# EAGLE design 2022-06-23 LN2 Autofill Controller (EAGLE 9.6.2)
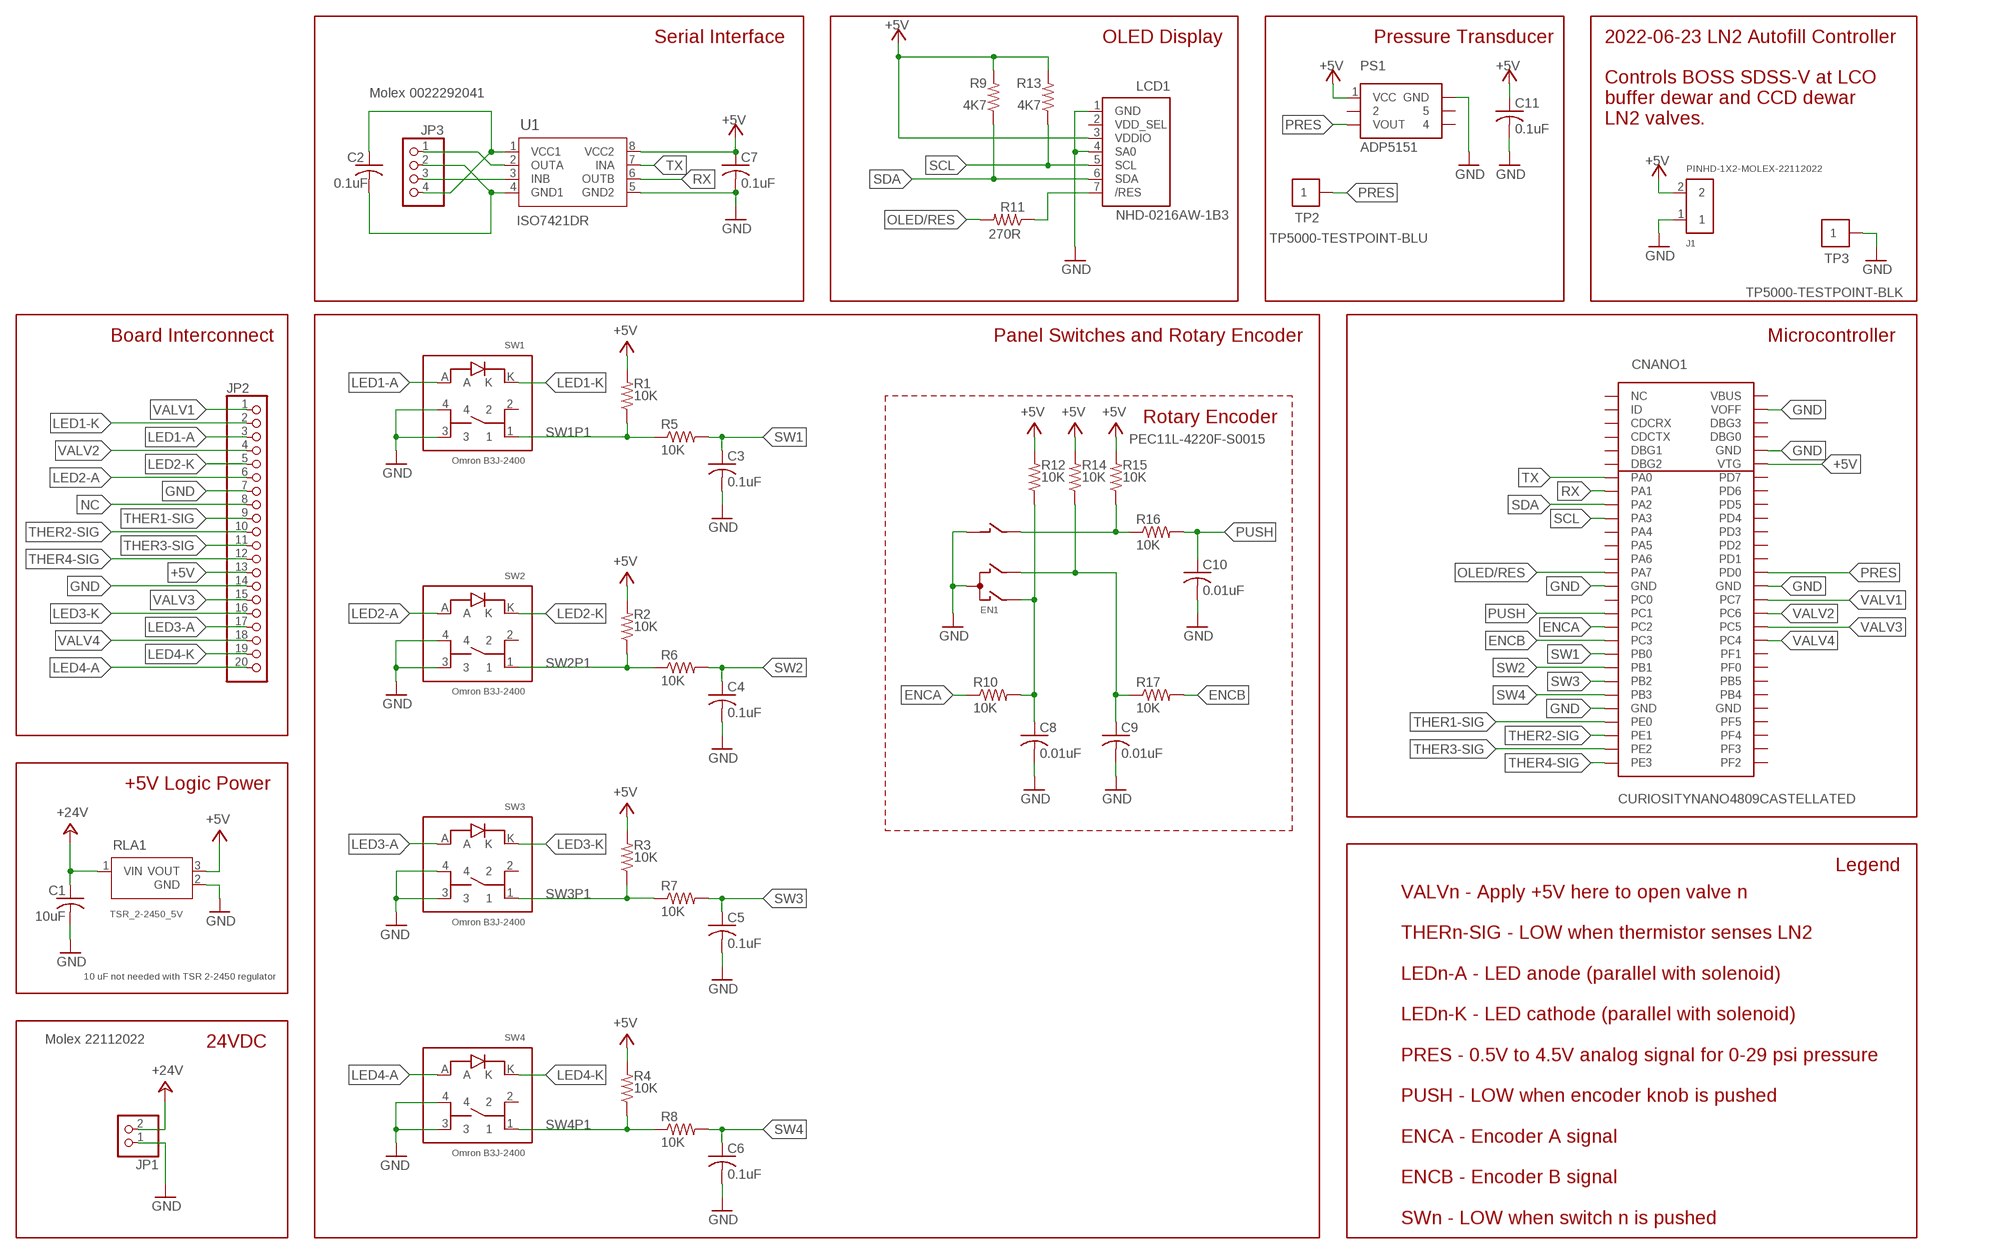
[diagram p0: schematic, sheet 1]

## Parts
C1  10uF  C-USC1210K  [C1210K]
C2  0.1uF  C-USC0805  [C0805]
C3  0.1uF  C-USC0805  [C0805]
C4  0.1uF  C-USC0805  [C0805]
C5  0.1uF  C-USC0805  [C0805]
C6  0.1uF  C-USC0805  [C0805]
C7  0.1uF  C-USC0805  [C0805]
C8  0.01uF  C-USC0805  [C0805]
C9  0.01uF  C-USC0805  [C0805]
C10  0.01uF  C-USC0805  [C0805]
C11  0.1uF  C-USC0805  [C0805]
CNANO1  CURIOSITYNANO4809CASTELLATED  [CURIOSITYNANO4809CASTELLATED]
EN1  PEC11L-4220F-S0015  ENC-BOURNES-PEC11L  [ENC-BOURNES-PEC11L]
J1  PINHD-1X2-MOLEX-22112022  [1X02-MOLEX-22112022]
JP1  Molex 22112022  PINHD-1X2MOLEX-02-VERT  [MOLEX-02-VERT]
JP2  PINHD-1X20  [1X20]
JP3  Molex 0022292041  PINHD-1X4MOLEX-04-VERT  [MOLEX-04-VERT]
LCD1  NHD-0216AW-1B3  LCD-NEWHAVEN-16X2  [LCD-NEWHAVEN-16X2]
PS1  ADP5151  PRESSURE-SENSOR-ADP5151  [PRESSURE-SENSOR-ADP5151]
R1  10K  R-US_R0805  [R0805]
R2  10K  R-US_R0805  [R0805]
R3  10K  R-US_R0805  [R0805]
R4  10K  R-US_R0805  [R0805]
R5  10K  R-US_R0805  [R0805]
R6  10K  R-US_R0805  [R0805]
R7  10K  R-US_R0805  [R0805]
R8  10K  R-US_R0805  [R0805]
R9  4K7  R-US_R0805  [R0805]
R10  10K  R-US_R0805  [R0805]
R11  270R  R-US_R0805  [R0805]
R12  10K  R-US_R0805  [R0805]
R13  4K7  R-US_R0805  [R0805]
R14  10K  R-US_R0805  [R0805]
R15  10K  R-US_R0805  [R0805]
R16  10K  R-US_R0805  [R0805]
R17  10K  R-US_R0805  [R0805]
RLA1  TSR_2-2450_5V  TSR_2-2450_5V_REGULATOR  [TSR2-SINGLE_TRP]
SW1  Omron B3J-2400  SWITCH-OMRON-B3J-1LED  [SWITCH-OMRON-B3J-1LED]
SW2  Omron B3J-2400  SWITCH-OMRON-B3J-1LED  [SWITCH-OMRON-B3J-1LED]
SW3  Omron B3J-2400  SWITCH-OMRON-B3J-1LED  [SWITCH-OMRON-B3J-1LED]
SW4  Omron B3J-2400  SWITCH-OMRON-B3J-1LED  [SWITCH-OMRON-B3J-1LED]
TP2  TP5000-TESTPOINT-BLU  [TP5000-TESTPOINT-BLU]
TP3  TP5000-TESTPOINT-BLK  [TP5000-TESTPOINT-BLK]
U1  ISO7421DR  ISO7421DRTI-SOIC-D8  [SOIC127P599X175-8N]

## Nets
+5V: C7.1 C11.1 CNANO1.VTG J1.2 JP2.13 LCD1.3(VDDIO) PS1.1(VCC) R1.2 R2.2 R3.2 R4.2 R9.2 R12.2 R13.2 R14.2 R15.2 RLA1.3(VOUT) U1.8(VCC2)
+24V: C1.1 JP1.2 RLA1.1(VIN)
/RES: LCD1.7(/RES) R11.1
ENCA: CNANO1.PC2 R10.1
ENCASW: C8.1 EN1.A R10.2 R12.1
ENCB: CNANO1.PC3 R17.2
ENCBSW: C9.1 EN1.B R14.1 R17.1
ENCBUTTON: EN1.1(B1) R15.1 R16.1
GND: C1.2 C3.2 C4.2 C5.2 C6.2 C7.2 C8.2 C9.2 C10.2 C11.2 CNANO1.GND15(GND) CNANO1.GND24(GND) CNANO1.GND42(GND) CNANO1.GND52(GND) CNANO1.VOFF EN1.2(C1) EN1.C J1.1 JP1.1 JP2.7 JP2.14 LCD1.1(GND) LCD1.4(SA0) PS1.6(GND) RLA1.2(GND) SW1.3 SW1.4 SW2.3 SW2.4 SW3.3 SW3.4 SW4.3 SW4.4 TP3.P$1 U1.5(GND2)
GND1: C2.2 JP3.2 U1.4(GND1)
INB: JP3.3 U1.3(INB)
LED1-A: JP2.3 SW1.A
LED1-K: JP2.2 SW1.K
LED2-A: JP2.6 SW2.A
LED2-K: JP2.5 SW2.K
LED3-A: JP2.17 SW3.A
LED3-K: JP2.16 SW3.K
LED4-A: JP2.20 SW4.A
LED4-K: JP2.19 SW4.K
NC: JP2.8
OLED/RES: CNANO1.PA7-SS(PA7) R11.2
OUTA: JP3.1 U1.2(OUTA)
PRES: CNANO1.PD0-AIN0(PD0) PS1.3(VOUT) TP2.P$1
PUSH: C10.1 CNANO1.PC1-RX(PC1) R16.2
RX: CNANO1.PA1-RX(PA1) U1.6(OUTB)
SCL: CNANO1.PA3-SCL(PA3) LCD1.5(SCL) R13.1
SDA: CNANO1.PA2-SDA(PA2) LCD1.6(SDA) R9.1
SW1: C3.1 CNANO1.PB0-TX(PB0) R5.2
SW1P1: R1.1 R5.1 SW1.1
SW2: C4.1 CNANO1.PB1-RX(PB1) R6.2
SW2P1: R2.1 R6.1 SW2.1
SW3: C5.1 CNANO1.PB2 R7.2
SW3P1: R3.1 R7.1 SW3.1
SW4: C6.1 CNANO1.PB3 R8.2
SW4P1: R4.1 R8.1 SW4.1
THER1-SIG: CNANO1.PE0 JP2.9
THER2-SIG: CNANO1.PE1 JP2.10
THER3-SIG: CNANO1.PE2 JP2.11
THER4-SIG: CNANO1.PE3 JP2.12
TX: CNANO1.PA0-TX(PA0) U1.7(INA)
VALV1: CNANO1.PC7 JP2.1
VALV2: CNANO1.PC6 JP2.4
VALV3: CNANO1.PC5 JP2.15
VALV4: CNANO1.PC4 JP2.18
VCC1: C2.1 JP3.4 U1.1(VCC1)
Unconnected: CNANO1.GND33(GND) CNANO1.ID CNANO1.NC CNANO1.PA4-MOSI(PA4) CNANO1.PA5-MISO(PA5) CNANO1.PA6-SCK(PA6) CNANO1.PB0-RX(CDCRX) CNANO1.PB1-TX(CDCTX) CNANO1.PB4 CNANO1.PB5 CNANO1.PC0-TX(PC0) CNANO1.PD1-AIN1(PD1) CNANO1.PD2-AIN2(PD2) CNANO1.PD3-AIN3(PD3) CNANO1.PD4-AIN4(PD4) CNANO1.PD5-AIN5(PD5) CNANO1.PD6-AIN6(PD6) CNANO1.PD7-AIN7(PD7) CNANO1.PF0-TOSC1(PF0) CNANO1.PF1-TOSC2(PF1) CNANO1.PF2 CNANO1.PF2-6(DBG2) CNANO1.PF3 CNANO1.PF3-5(DBG1) CNANO1.PF4 CNANO1.PF5-LED(PF5) CNANO1.PF6-SW0(DBG3) CNANO1.UPDI(DBG0) CNANO1.VBUS LCD1.2(VDD_SEL) PS1.2 PS1.4 PS1.5 SW1.2 SW2.2 SW3.2 SW4.2

## Notes on the sheet
- Serial Interface | OLED Display | Pressure Transducer
- 2022-06-23 LN2 Autofill Controller
  
  Controls BOSS SDSS-V at LCO
  buffer dewar and CCD dewar
  LN2 valves.
- Board Interconnect | Panel Switches and Rotary Encoder | Microcontroller
- Rotary Encoder
- +5V Logic Power
- Legend
- 10 uF not needed with TSR 2-2450 regulator
- 24VDC
- VALVn - Apply +5V here to open valve n
  
  THERn-SIG - LOW when thermistor senses LN2
  
  LEDn-A - LED anode (parallel with solenoid)
  
  LEDn-K - LED cathode (parallel with solenoid)
  
  PRES - 0.5V to 4.5V analog signal for 0-29 psi pressure
  
  PUSH - LOW when encoder knob is pushed 
  
  ENCA - Encoder A signal
  
  ENCB - Encoder B signal
  
  SWn - LOW when switch n is pushed

## Library data of the parts
C1-C11 = AUmlib:C-US: CAPACITOR, American symbol; SPICEPREFIX: C
CNANO1 = AUmlib:CURIOSITYNANO4809
EN1 = AUmlib:ENC-BOURNES-PEC11L
J1 = AUmlib:PINHD-1X2-MOLEX-22112022
JP1 = AUmlib:PINHD-1X2: PIN HEADER
JP2 = AUmlib:PINHD-1X20: PIN HEADER
JP3 = AUmlib:PINHD-1X4: PIN HEADER
LCD1 = AUmlib:LCD-NEWHAVEN-16X2: Newhaven I2C LCD 16x2
PS1 = AUmlib:PRESSURE-SENSOR-ADP5151
R1-R17 = AUmlib:R-US_: RESISTOR, American symbol; SPICEPREFIX: R
RLA1 = AUmlib:TSR_2-2450_5V_REGULATOR; COPYRIGHT: Copyright (C) 2022 Ultra Librarian. All rights reserved.; DIGI-KEY_PART_NUMBER_1: 1951-2692-ND; MANUFACTURER_PART_NUMBER: TSR 2-2450; MFR_NAME: Traco Power
SW1-SW4 = AUmlib:SWITCH-OMRON-B3J-1LED: Omron B3J-2400 SPST MOM 1-LED
TP2 = AUmlib:TP5000-TESTPOINT-BLU
TP3 = AUmlib:TP5000-TESTPOINT-BLK
U1 = AUmlib:ISO7421DR: ISO7421 Dual channel digital isolator.

## Board
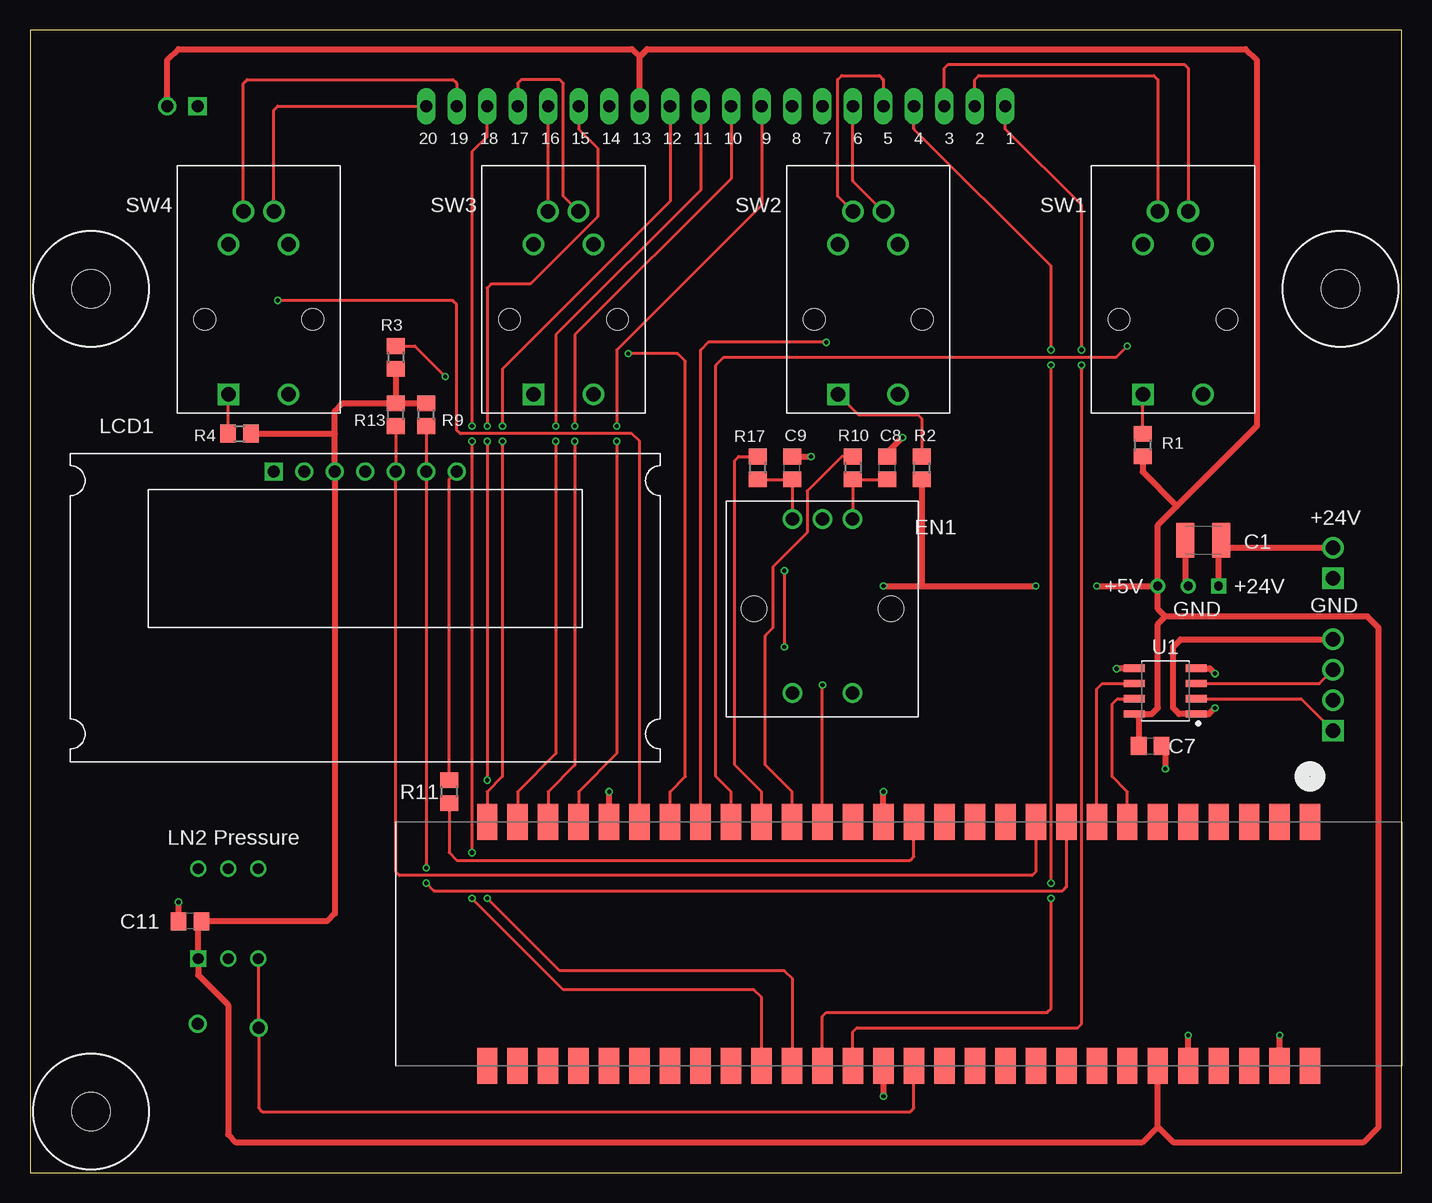
[diagram p1: board, top side]
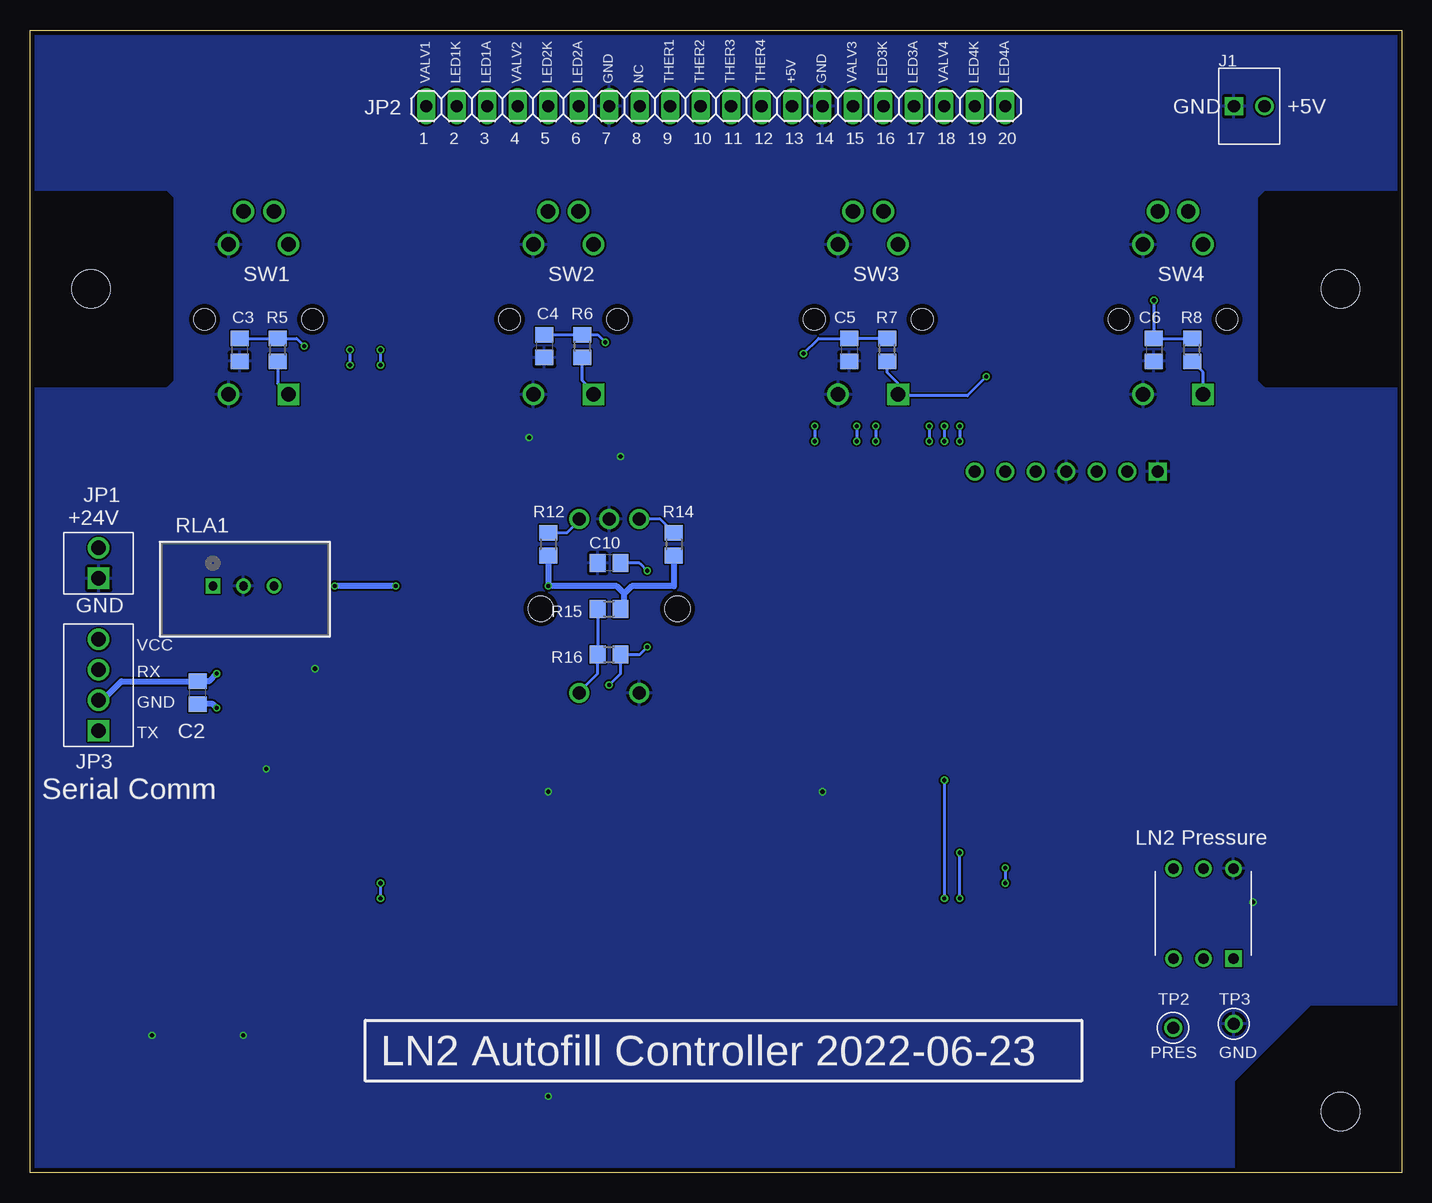
[diagram p2: board, bottom side, seen from below]

Size 114.3 x 95.25 mm. Coordinates in mm from the lower left corner, seen from the top.
Outline: 0,0 114.3,0 114.3,95.25 0,95.25 0,0
Copper layers (1*16): Top 0.035559375mm / dielectric 1.6mm / Bottom 0.035559375mm
Design rules "oshpark-2layer": minimum track width 6mil, minimum drill 10mil, track to track 6mil, track to pad 6mil, pad to pad 6mil, via to via 6mil, smd to smd 6mil, copper to edge 15mil, drill to drill 6mil, minimum pad ring 5mil, minimum via ring 5mil, stop-mask expansion 2.5mil, vias tented up to drill 0mil, thermal gap 10mil
Holes 3.17 mm at 5.08,73.66 109.22,73.66 5.08,5.08

### Footprints (pad centres in the part's own frame; a part is rotated, then mirrored left to right if it is on the bottom)
C1210K = smd 1.5 x 2.9: 1 -1.5,0; 2 1.5,0
C0805 = smd 1.3 x 1.5: 1 -0.95,0; 2 0.95,0
CURIOSITYNANO4809CASTELLATED = smd 3 x 1.7: GND15 -10.16,-1.27; GND24 -10.16,-24.13; GND33 10.16,-24.13; GND42 10.16,-1.27; GND52 10.16,24.13; ID -10.16,31.75; NC -10.16,34.29; PA0-TX -10.16,19.05; PA1-RX -10.16,16.51; PA2-SDA -10.16,13.97; PA3-SCL -10.16,11.43; PA4-MOSI -10.16,8.89; PA5-MISO -10.16,6.35; PA6-SCK -10.16,3.81; PA7-SS -10.16,1.27; PB0-RX -10.16,29.21; PB0-TX -10.16,-13.97; PB1-RX -10.16,-16.51; PB1-TX -10.16,26.67; PB2 -10.16,-19.05; PB3 -10.16,-21.59; PB4 10.16,-21.59; PB5 10.16,-19.05; PC0-TX -10.16,-3.81; PC1-RX -10.16,-6.35; PC2 -10.16,-8.89; PC3 -10.16,-11.43; PC4 10.16,-11.43; PC5 10.16,-8.89; PC6 10.16,-6.35; PC7 10.16,-3.81; PD0-AIN0 10.16,1.27; PD1-AIN1 10.16,3.81; PD2-AIN2 10.16,6.35; PD3-AIN3 10.16,8.89; PD4-AIN4 10.16,11.43; PD5-AIN5 10.16,13.97; PD6-AIN6 10.16,16.51; PD7-AIN7 10.16,19.05; PE0 -10.16,-26.67; PE1 -10.16,-29.21; PE2 -10.16,-31.75; PE3 -10.16,-34.29; PF0-TOSC1 10.16,-16.51; PF1-TOSC2 10.16,-13.97; PF2 10.16,-34.29; PF2-6 -10.16,21.59; PF3 10.16,-31.75; PF3-5 -10.16,24.13; PF4 10.16,-29.21; PF5-LED 10.16,-26.67; PF6-SW0 10.16,29.21; UPDI 10.16,26.67; VBUS 10.16,34.29; VOFF 10.16,31.75; VTG 10.16,21.59
ENC-BOURNES-PEC11L = drill 1.1: 1 -2.5,7; 2 2.5,7; A -2.5,-7.5; B 2.5,-7.5; C 0,-7.5 | hole 2.1: -5.7,0; 5.7,0
1X02-MOLEX-22112022 = drill 1.016 square: 1 -1.27,0 | drill 1.016: 2 1.27,0
MOLEX-02-VERT = drill 1.194 square: 1 0,0 | drill 1.194: 2 2.54,0
1X20 = drill 1.016 long: 1 -24.13,0; 2 -21.59,0; 3 -19.05,0; 4 -16.51,0; 5 -13.97,0; 6 -11.43,0; 7 -8.89,0; 8 -6.35,0; 9 -3.81,0; 10 -1.27,0; 11 1.27,0; 12 3.81,0; 13 6.35,0; 14 8.89,0; 15 11.43,0; 16 13.97,0; 17 16.51,0; 18 19.05,0; 19 21.59,0; 20 24.13,0
MOLEX-04-VERT = drill 1.194 square: 1 -3.81,0 | drill 1.194: 2 -1.27,0; 3 1.27,0; 4 3.81,0
LCD-NEWHAVEN-16X2 = drill 1 square: 1 -7.62,0 | drill 1: 2 -5.08,0; 3 -2.54,0; 4 0,0; 5 2.54,0; 6 5.08,0; 7 7.62,0
PRESSURE-SENSOR-ADP5151 = drill 0.9 square: 1 -2.5,3.75 | drill 0.9: 2 0,3.75; 3 2.5,3.75; 4 2.5,-3.75; 5 0,-3.75; 6 -2.5,-3.75
R0805 = smd 1.3 x 1.5: 1 -0.95,0; 2 0.95,0
TSR2-SINGLE_TRP = drill 0.711 pad 1.219 square: 1 0,0 | drill 0.711 pad 1.219: 2 2.54,0; 3 5.08,0
SWITCH-OMRON-B3J-1LED = drill 1.2 square: 1 -2.5,-6.25 | drill 1.2: 2 -2.5,6.25; 3 2.5,-6.25; 4 2.5,6.25; A 1.27,9; K -1.27,9 | hole 1.8: -4.5,0; 4.5,0
TP5000-TESTPOINT-BLU = drill 1: P$1 0,0
TP5000-TESTPOINT-BLK = drill 1: P$1 0,0
SOIC127P599X175-8N = smd 1.751 x 0.599: 1 -2.578,1.905; 2 -2.578,0.635; 3 -2.578,-0.635; 4 -2.578,-1.905; 5 2.578,-1.905; 6 2.578,-0.635; 7 2.578,0.635; 8 2.578,1.905

### Placement (x,y rotation side)
C1  97.79,52.7 180 top
C2  100.33,40.01 90 bottom
C3  96.84,68.58 270 bottom
C4  71.44,68.9 270 bottom
C5  46.04,68.58 270 bottom
C6  20.64,68.58 270 bottom
C7  93.34,35.56 0 top
C8  71.44,58.74 90 top
C9  63.5,58.74 90 top
C10  66.04,50.8 180 bottom
C11  13.34,20.95 180 top
CNANO1  72.39,19.05 270 top
EN1  66.04,46.99 180 top
J1  12.7,88.9 0 bottom
JP1  108.58,49.53 90 bottom
JP2  57.15,88.9 0 bottom
JP3  108.58,40.64 90 bottom
LCD1  27.94,58.42 0 top
PS1  16.51,21.59 180 bottom
R1  92.71,60.64 270 top
R2  74.3,58.74 270 top
R3  30.48,67.94 270 top
R4  17.46,61.59 0 top
R5  93.66,68.58 90 bottom
R6  68.26,68.9 90 bottom
R7  42.86,68.58 90 bottom
R8  17.46,68.58 90 bottom
R9  33.02,63.18 90 top
R10  68.58,58.74 270 top
R11  34.92,31.75 270 top
R12  71.12,52.39 270 bottom
R13  30.48,63.18 90 top
R14  60.64,52.39 270 bottom
R15  66.04,46.99 0 bottom
R16  66.04,43.18 0 bottom
R17  60.64,58.74 90 top
RLA1  99.06,48.9 0 bottom
SW1  95.25,71.12 0 top
SW2  69.85,71.12 0 top
SW3  44.45,71.12 0 top
SW4  19.05,71.12 0 top
TP2  19.05,12.06 0 bottom
TP3  13.97,12.38 0 bottom
U1  94.61,40.13 180 top

### Tracks (layer width: path | path; a pad name or v marks a point on that pad's centre or on a via)
+5V  (via drill 0.35)
  Top 0.254: U1.8 92.39,37.87
  Top 0.508: 92.39,37.87 C7.1 | 25.4,61.59 LCD1.3 25.4,21.59 24.77,20.95 C11.1 14.01,20.68 PS1.1 14.01,16.47 16.51,13.97 16.51,3.17 17.14,2.54 92.71,2.54 93.98,3.81 | 25.4,61.59 25.4,63.5 26.04,64.14 R13.2 | R13.2 R9.2 | 93.98,3.81 CNANO1.VTG | 93.98,3.81 95.25,2.54 111.12,2.54 112.39,3.81 112.39,45.4 111.44,46.35 94.61,46.35 | 94.61,46.35 93.98,46.99 RLA1.3 | U1.8 93.47,38.23 93.98,38.73 93.98,45.72 94.61,46.35 | JP2.13 50.8,93.03 | 50.8,93.03 51.44,93.66 101.28,93.66 102.23,92.71 102.23,62.23 95.57,55.56 | 95.57,55.56 93.98,53.98 RLA1.3 | 50.8,93.03 50.16,93.66 12.38,93.66 11.43,92.71 J1.2 | R4.2 25.4,61.59 | v71.12,48.9 74.3,48.9 | 74.3,48.9 v83.82,48.9 | R2.2 74.3,48.9 | R1.2 92.71,58.42 95.57,55.56 | R3.2 R13.2 | v88.9,48.9 RLA1.3
  Bottom 0.508: 64.77,48.26 64.14,48.9 60.64,48.9 R14.2 | 64.77,48.26 65.41,48.9 v71.12,48.9 R12.2 | R15.2 64.77,47.31 64.77,48.26 | v83.82,48.9 v88.9,48.9
+24V
  Top 0.508: JP1.2 99.69,52.07 99.29,52.48 C1.1 99.06,52.48 RLA1.1
/RES
  Top 0.254: R11.1 34.92,57.78 LCD1.7
ENCA
  Top 0.254: CNANO1.PC2 63.5,31.75 61.28,33.97 61.28,44.77 61.91,45.4 61.91,50.48 64.77,53.34 64.77,56.83 67.62,59.69 R10.1
ENCASW
  Top 0.254: C8.1 R10.2 68.58,54.53 EN1.A
  Bottom 0.254: R12.1 69.53,53.34 68.54,54.33 EN1.A
ENCB
  Top 0.254: CNANO1.PC3 60.96,31.75 58.74,33.97 58.74,59.37 59.05,59.69 R17.2
ENCBSW
  Top 0.254: R17.1 C9.1 63.54,57.75 EN1.B
  Bottom 0.254: R14.1 61.8,54.49 EN1.B
ENCBUTTON
  Bottom 0.254: R15.1 R16.1 66.99,41.59 68.59,39.99 EN1.1
GND  (via drill 0.35)
  Top 0.508: C11.2 v12.38,22.54 | C7.2 94.61,35.24 v94.61,33.66 | CNANO1.GND24 v48.26,31.75 | CNANO1.GND15 v71.12,31.75 | CNANO1.GND42 v71.12,6.35 | CNANO1.GND52 v96.52,11.43 | CNANO1.VOFF v104.14,11.43 | U1.5 92.04,42.01 v90.55,42.01 | C9.2 v65.09,59.69 | C8.2 71.44,60.01 v72.71,61.28 | C1.2 96.29,49.12 RLA1.2
  pour Bottom: 114.3,0 114.3,65.41 102.87,65.41 102.23,66.04 102.23,81.28 102.87,81.92 114.3,81.92 114.3,95.25 0,95.25 0,81.92 11.43,81.92 12.06,81.28 12.06,66.04 11.43,65.41 0,65.41 0,13.97 7.62,13.97 13.97,7.62 13.97,0
GND1  (via drill 0.35)
  Top 0.508: U1.4 98.3,42.04 v98.74,41.59
  Bottom 0.508: v98.74,41.59 99.38,40.95 C2.2 106.68,40.96 108.27,39.37 JP3.2
INB
  Top 0.254: U1.3 107.44,40.77 JP3.3
LED1-A
  Top 0.254: JP2.3 76.2,92.08 76.52,92.39 96.2,92.39 96.52,92.08 SW1.A
LED1-K
  Top 0.254: JP2.2 78.74,91.12 79.06,91.44 93.66,91.44 93.98,91.12 SW1.K
LED2-A
  Top 0.254: SW2.A 68.58,82.66 JP2.6
LED2-K
  Top 0.254: SW2.K 67.31,81.39 67.31,91.12 67.63,91.44 70.8,91.44 71.12,91.12 JP2.5
LED3-A
  Top 0.254: SW3.A 44.45,81.39 44.45,90.81 44.13,91.12 40.96,91.12 40.64,90.81 JP2.17
LED3-K
  Top 0.254: SW3.K JP2.16
LED4-A
  Top 0.254: SW4.A 20.32,88.58 20.64,88.9 JP2.20
LED4-K
  Top 0.254: SW4.K 17.78,90.81 18.1,91.12 35.24,91.12 35.56,90.81 JP2.19
OLED/RES
  Top 0.254: R11.2 34.92,26.67 35.56,26.04 73.34,26.04 73.66,26.35 CNANO1.PA7-SS
OUTA
  Top 0.254: U1.2 105.92,39.5 JP3.1
PRES
  Top 0.254: CNANO1.PD0-AIN0 73.66,5.4 73.34,5.08 19.37,5.08 19.05,5.4 TP2.P$1 19.01,12.11 PS1.3
PUSH  (via drill 0.35)
  Top 0.254: CNANO1.PC1-RX v66.04,40.64 | v62.87,50.16 v62.87,43.81
  Bottom 0.254: v66.04,40.64 65.09,41.59 R16.2 63.5,43.18 v62.87,43.81 | v62.87,50.16 63.5,50.8 C10.1
RX
  Top 0.254: CNANO1.PA1-RX 88.9,40.32 89.34,40.77 U1.6
SCL
  Top 0.254: CNANO1.PA3-SCL 83.82,25.08 83.5,24.77 30.8,24.77 30.48,25.08 LCD1.5 R13.1
SDA  (via drill 0.35)
  Top 0.254: CNANO1.PA2-SDA 86.36,23.81 86.04,23.5 33.66,23.5 v33.02,24.13 | R9.1 LCD1.6 v33.02,25.4
  Bottom 0.254: v33.02,25.4 v33.02,24.13
SW1  (via drill 0.35)
  Top 0.254: CNANO1.PB0-TX 58.42,31.75 57.15,33.02 57.15,67.31 57.78,67.94 90.49,67.94 v91.44,68.9
  Bottom 0.254: C3.1 R5.2 92.08,69.53 v91.44,68.9
SW1P1
  Top 0.254: R1.1 92.71,64.83 SW1.1
  Bottom 0.254: SW1.1 93.66,65.78 R5.1
SW2  (via drill 0.35)
  Top 0.254: CNANO1.PB1-RX 55.88,68.58 56.52,69.22 v66.36,69.22
  Bottom 0.254: C4.1 R6.2 66.99,69.85 v66.36,69.22
SW2P1
  Top 0.254: SW2.1 69.04,63.18 73.98,63.18 74.3,62.87 R2.1
  Bottom 0.254: SW2.1 67.35,65.13 68.26,66.04 R6.1
SW3  (via drill 0.35)
  Top 0.254: CNANO1.PB2 53.34,31.75 54.61,33.02 54.61,67.63 53.98,68.26 v49.85,68.26
  Bottom 0.254: v49.85,68.26 48.58,69.53 C5.1 R7.2
SW3P1  (via drill 0.35)
  Top 0.254: R3.1 32.07,68.9 v34.61,66.36
  Bottom 0.254: R7.1 42.86,66.67 41.95,65.76 SW3.1 41.85,64.77 36.2,64.77 v34.61,66.36
SW4  (via drill 0.35)
  Top 0.254: CNANO1.PB3 50.8,60.96 50.16,61.59 35.88,61.59 35.56,61.91 35.56,72.39 35.24,72.71 v20.64,72.71
  Bottom 0.254: R8.2 C6.1 v20.64,72.71
SW4P1
  Top 0.254: R4.1 16.51,64.83 SW4.1
  Bottom 0.254: SW4.1 16.55,66.72 R8.1
THER1-SIG  (via drill 0.35)
  Top 0.254: JP2.9 60.96,80.64 48.9,68.58 v48.9,62.23 | v48.9,60.96 48.9,34.92 45.72,31.75 CNANO1.PE0
  Bottom 0.254: v48.9,62.23 v48.9,60.96
THER2-SIG  (via drill 0.35)
  Top 0.254: JP2.10 58.42,82.87 45.4,69.85 v45.4,62.23 | CNANO1.PE1 43.18,31.75 45.4,33.97 v45.4,60.96
  Bottom 0.254: v45.4,62.23 v45.4,60.96
THER3-SIG  (via drill 0.35)
  Top 0.254: CNANO1.PE2 40.64,31.75 43.81,34.92 v43.81,60.96 | JP2.11 55.88,81.92 43.81,69.85 v43.81,62.23
  Bottom 0.254: v43.81,62.23 v43.81,60.96
THER4-SIG  (via drill 0.35)
  Top 0.254: JP2.12 53.34,80.96 39.37,66.99 v39.37,62.23 | CNANO1.PE3 38.1,31.75 39.37,33.02 v39.37,60.96
  Bottom 0.254: v39.37,62.23 v39.37,60.96
TX
  Top 0.254: CNANO1.PA0-TX 91.44,31.75 90.17,33.02 90.17,39.05 90.61,39.5 U1.7
VALV1  (via drill 0.35)
  Top 0.254: CNANO1.PC7 68.58,11.75 68.9,12.06 87.31,12.06 87.63,12.38 v87.63,67.31 | v87.63,68.58 87.63,80.64 81.28,87 JP2.1
  Bottom 0.254: v87.63,67.31 v87.63,68.58
VALV2  (via drill 0.35)
  Top 0.254: CNANO1.PC6 66.04,13.02 66.36,13.34 84.77,13.34 85.09,13.65 v85.09,22.86 | v85.09,24.13 v85.09,67.31 | v85.09,68.58 85.09,75.56 73.66,87 JP2.4
  Bottom 0.254: v85.09,22.86 v85.09,24.13 | v85.09,67.31 v85.09,68.58
VALV3  (via drill 0.35)
  Top 0.254: JP2.15 45.72,87 47.31,85.41 47.31,79.69 41.68,74.06 38.44,74.06 38.1,73.73 v38.1,62.23 | v38.1,22.86 44.13,16.83 62.87,16.83 63.5,16.19 CNANO1.PC5 | v38.1,60.96 v38.1,32.7
  Bottom 0.254: v38.1,32.7 v38.1,22.86 | v38.1,62.23 v38.1,60.96
VALV4  (via drill 0.35)
  Top 0.254: CNANO1.PC4 60.96,14.61 60.33,15.24 44.45,15.24 v36.83,22.86 | JP2.18 38.1,86.36 36.83,85.09 v36.83,62.23 | v36.83,60.96 v36.83,26.67
  Bottom 0.254: v36.83,22.86 v36.83,26.67 | v36.83,62.23 v36.83,60.96
VCC1  (via drill 0.35)
  Top 0.508: v98.74,38.73 98.23,38.23 U1.1 95.76,38.23 95.25,38.73 95.25,43.81 95.89,44.45 JP3.4
  Bottom 0.508: v98.74,38.73 99.06,39.05 C2.1

### Text on the board
tPlace: 20 | 19 | 18 | 17 | 16 | 15 | 14 | 13 | 12 | 11 | 10 | 9 | 8 | 7 | 6 | 5 | 4 | 3 | 2 | 1 | +24V | +5V | +24V | GND | GND | LN2 Pressure
bPlace: LED4A | LED4K | VALV4 | LED3A | LED3K | VALV3 | GND | +5V | THER4 | THER3 | THER2 | THER1 | NC | GND | LED2A | LED2K | VALV2 | LED1A | LED1K | VALV1 | +5V | GND | 20 | 19 | 18 | 17 | 16 | 15 | 14 | 13 | 12 | 11 | 10 | 9 | 8 | 7 | 6 | 5 | 4 | 3 | 2 | 1 | SW4 | SW3 | SW2 | SW1 | +24V | GND | VCC | RX | GND | TX | Serial Comm | LN2 Pressure | GND | PRES | LN2 Autofill Controller 2022-06-23